# EAGLE schematic bc-module-probe (EAGLE 7.7.0)
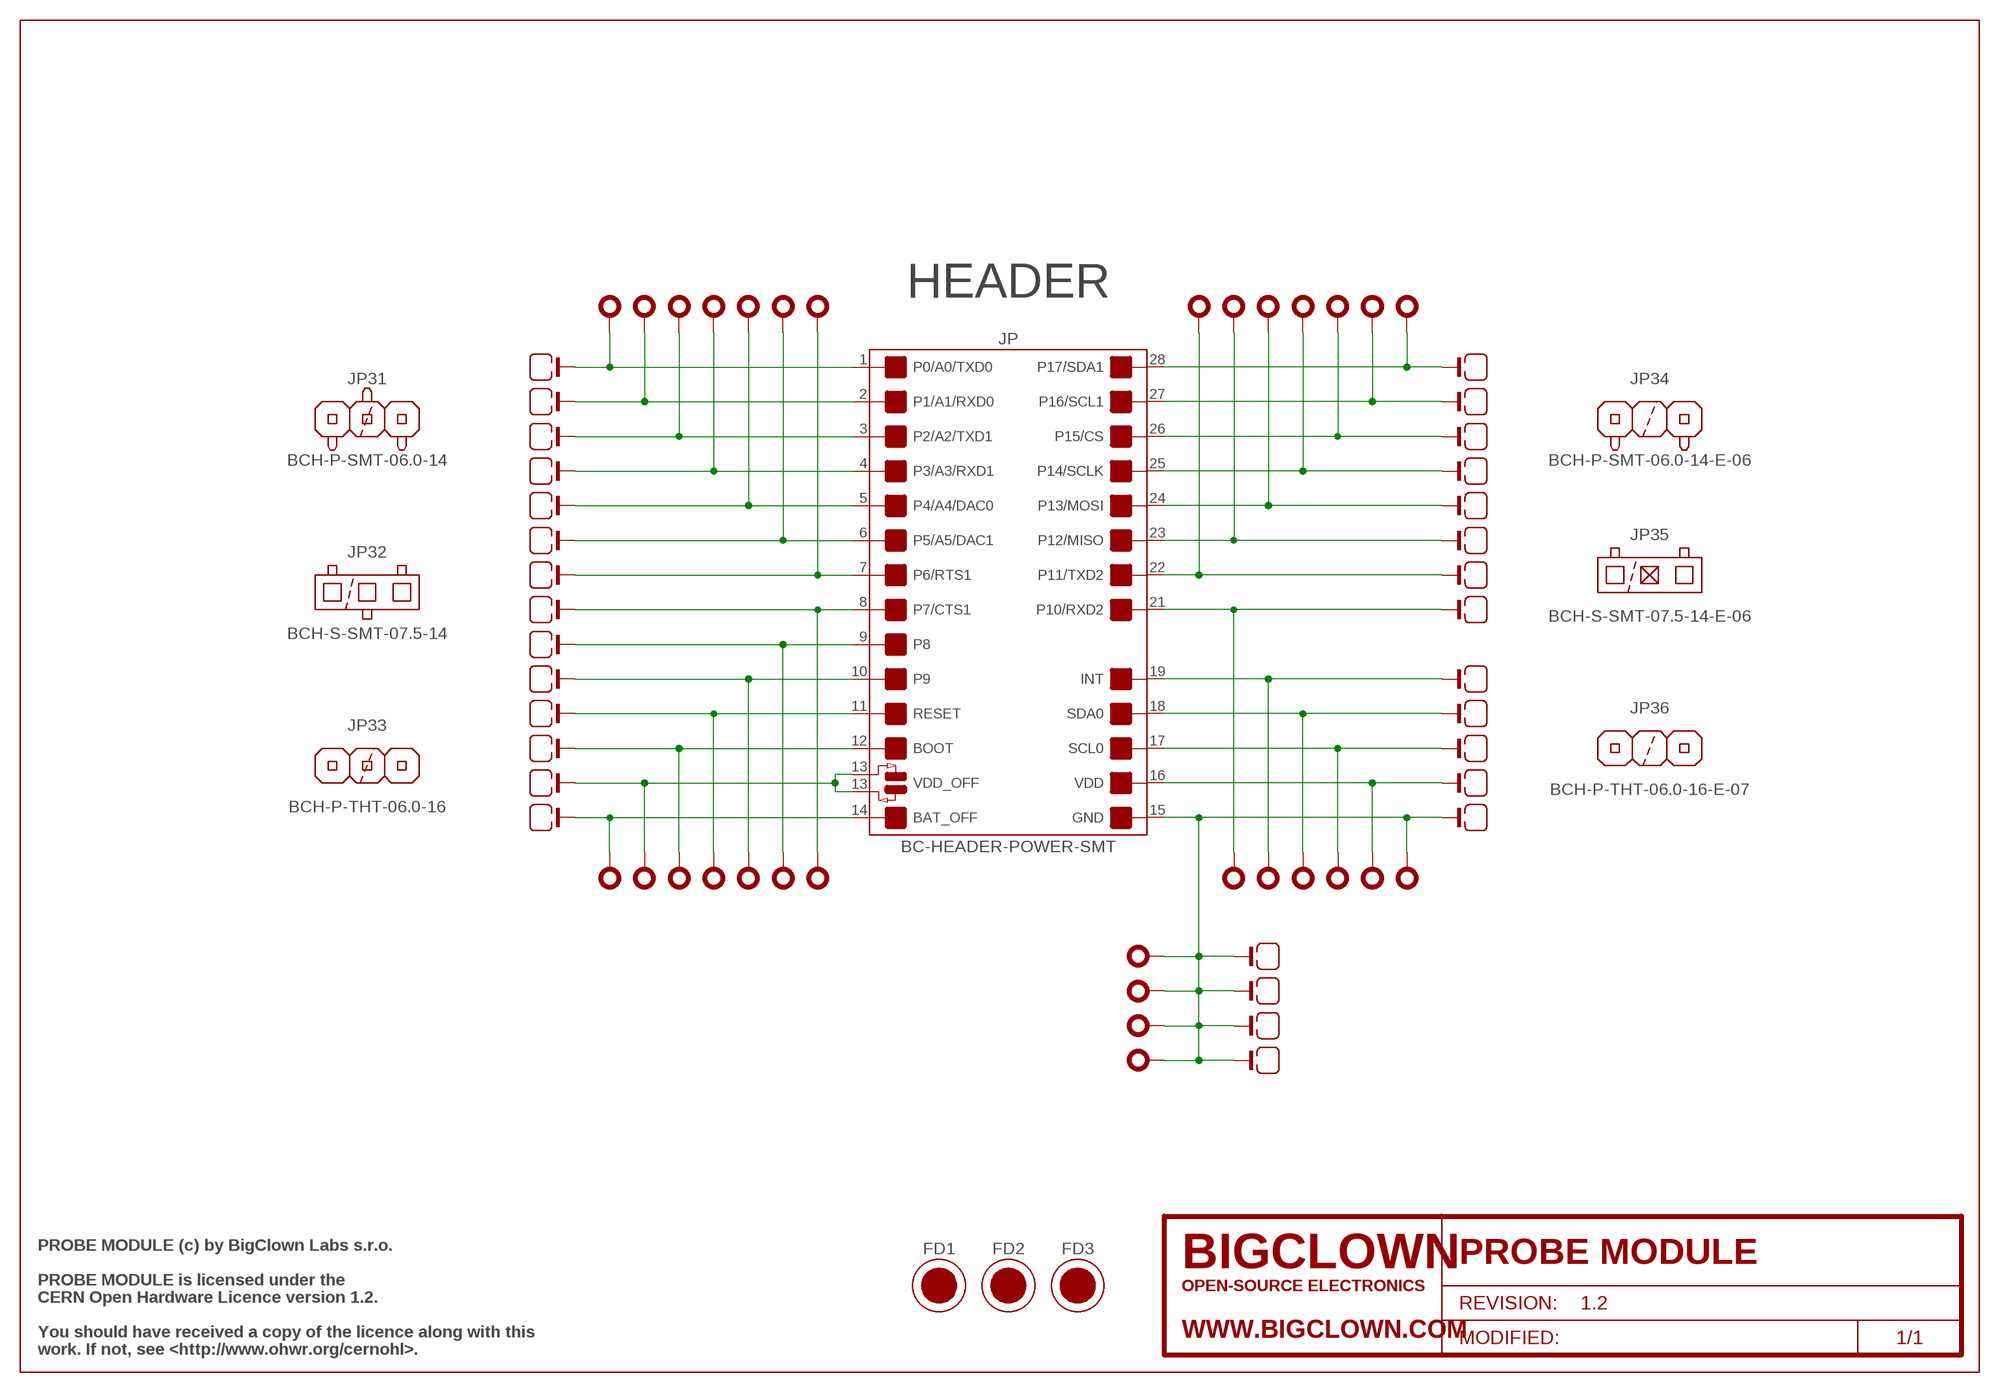
[diagram p0: schematic, sheet 1]

## Parts
FD1  FIDUCIAL  [FIDUCIAL-1MM]
FD2  FIDUCIAL  [FIDUCIAL-1MM]
FD3  FIDUCIAL  [FIDUCIAL-1MM]
FRAME1  FRAME-SCH/A4L-BRD/A4L  [FRAME-A4L]
JP  BC-HEADER-POWER-SMT  [BC-HEADER-POWER-SMT]
JP1  BC-HEADER-PIN-THT  [BC-HEADER-PIN-THT]
JP2  BC-HEADER-PIN-THT  [BC-HEADER-PIN-THT]
JP3  BC-HEADER-PIN-THT  [BC-HEADER-PIN-THT]
JP4  BC-HEADER-PIN-THT  [BC-HEADER-PIN-THT]
JP5  BC-HEADER-PIN-THT  [BC-HEADER-PIN-THT]
JP6  BC-HEADER-PIN-THT  [BC-HEADER-PIN-THT]
JP7  BC-HEADER-PIN-THT  [BC-HEADER-PIN-THT]
JP8  BC-HEADER-PIN-THT  [BC-HEADER-PIN-THT]
JP9  BC-HEADER-PIN-THT  [BC-HEADER-PIN-THT]
JP10  BC-HEADER-PIN-THT  [BC-HEADER-PIN-THT]
JP11  BC-HEADER-PIN-THT  [BC-HEADER-PIN-THT]
JP12  BC-HEADER-PIN-THT  [BC-HEADER-PIN-THT]
JP13  BC-HEADER-PIN-THT  [BC-HEADER-PIN-THT]
JP14  BC-HEADER-PIN-THT  [BC-HEADER-PIN-THT]
JP15  BC-HEADER-PIN-THT  [BC-HEADER-PIN-THT]
JP16  BC-HEADER-PIN-THT  [BC-HEADER-PIN-THT]
JP17  BC-HEADER-PIN-THT  [BC-HEADER-PIN-THT]
JP18  BC-HEADER-PIN-THT  [BC-HEADER-PIN-THT]
JP19  BC-HEADER-PIN-THT  [BC-HEADER-PIN-THT]
JP21  BC-HEADER-PIN-THT  [BC-HEADER-PIN-THT]
JP22  BC-HEADER-PIN-THT  [BC-HEADER-PIN-THT]
JP23  BC-HEADER-PIN-THT  [BC-HEADER-PIN-THT]
JP24  BC-HEADER-PIN-THT  [BC-HEADER-PIN-THT]
JP25  BC-HEADER-PIN-THT  [BC-HEADER-PIN-THT]
JP26  BC-HEADER-PIN-THT  [BC-HEADER-PIN-THT]
JP27  BC-HEADER-PIN-THT  [BC-HEADER-PIN-THT]
JP28  BC-HEADER-PIN-THT  [BC-HEADER-PIN-THT]
JP31  BCH-P-SMT-06.0-14  JP-BCH-P-SMT-06.0-14  [BCH-P-SMT-14]
JP32  BCH-S-SMT-07.5-14  JP-BCH-S-SMT-07.5-14  [BCH-S-SMT-14]
JP33  BCH-P-THT-06.0-16  JP-BCH-P-THT-06.0-16  [BCH-P-THT-16]
JP34  BCH-P-SMT-06.0-14-E-06  JP-BCH-P-SMT-06.0-14-E-06  [BCH-P-SMT-14-E-06]
JP35  BCH-S-SMT-07.5-14-E-06  JP-BCH-S-SMT-07.5-14-E-06  [BCH-S-SMT-14-E-06]
JP36  BCH-P-THT-06.0-16-E-07  JP-BCH-P-THT-06.0-16-E-07  [BCH-P-THT-16-E07]
JPG1  BC-HEADER-PIN-THT  [BC-HEADER-PIN-THT]
JPG2  BC-HEADER-PIN-THT  [BC-HEADER-PIN-THT]
JPG3  BC-HEADER-PIN-THT  [BC-HEADER-PIN-THT]
JPG4  BC-HEADER-PIN-THT  [BC-HEADER-PIN-THT]
JS1  KEYSTONE-5019  JP-KEYSTONE-5019  [KEYSTONE-5019_R]
JS2  KEYSTONE-5019  JP-KEYSTONE-5019  [KEYSTONE-5019_R]
JS3  KEYSTONE-5019  JP-KEYSTONE-5019  [KEYSTONE-5019_R]
JS4  KEYSTONE-5019  JP-KEYSTONE-5019  [KEYSTONE-5019_R]
JS5  KEYSTONE-5019  JP-KEYSTONE-5019  [KEYSTONE-5019_R]
JS6  KEYSTONE-5019  JP-KEYSTONE-5019  [KEYSTONE-5019_R]
JS7  KEYSTONE-5019  JP-KEYSTONE-5019  [KEYSTONE-5019_R]
JS8  KEYSTONE-5019  JP-KEYSTONE-5019  [KEYSTONE-5019_R]
JS9  KEYSTONE-5019  JP-KEYSTONE-5019  [KEYSTONE-5019_R]
JS10  KEYSTONE-5019  JP-KEYSTONE-5019  [KEYSTONE-5019_R]
JS11  KEYSTONE-5019  JP-KEYSTONE-5019  [KEYSTONE-5019_R]
JS12  KEYSTONE-5019  JP-KEYSTONE-5019  [KEYSTONE-5019_R]
JS13  KEYSTONE-5019  JP-KEYSTONE-5019  [KEYSTONE-5019_R]
JS14  KEYSTONE-5019  JP-KEYSTONE-5019  [KEYSTONE-5019_R]
JS15  KEYSTONE-5019  JP-KEYSTONE-5019  [KEYSTONE-5019_R]
JS16  KEYSTONE-5019  JP-KEYSTONE-5019  [KEYSTONE-5019_R]
JS17  KEYSTONE-5019  JP-KEYSTONE-5019  [KEYSTONE-5019_R]
JS18  KEYSTONE-5019  JP-KEYSTONE-5019  [KEYSTONE-5019_R]
JS19  KEYSTONE-5019  JP-KEYSTONE-5019  [KEYSTONE-5019_R]
JS21  KEYSTONE-5019  JP-KEYSTONE-5019  [KEYSTONE-5019_R]
JS22  KEYSTONE-5019  JP-KEYSTONE-5019  [KEYSTONE-5019_R]
JS23  KEYSTONE-5019  JP-KEYSTONE-5019  [KEYSTONE-5019_R]
JS24  KEYSTONE-5019  JP-KEYSTONE-5019  [KEYSTONE-5019_R]
JS25  KEYSTONE-5019  JP-KEYSTONE-5019  [KEYSTONE-5019_R]
JS26  KEYSTONE-5019  JP-KEYSTONE-5019  [KEYSTONE-5019_R]
JS27  KEYSTONE-5019  JP-KEYSTONE-5019  [KEYSTONE-5019_R]
JS28  KEYSTONE-5019  JP-KEYSTONE-5019  [KEYSTONE-5019_R]
JSG1  KEYSTONE-5019  JP-KEYSTONE-5019  [KEYSTONE-5019_R]
JSG2  KEYSTONE-5019  JP-KEYSTONE-5019  [KEYSTONE-5019_R]
JSG3  KEYSTONE-5019  JP-KEYSTONE-5019  [KEYSTONE-5019_R]
JSG4  KEYSTONE-5019  JP-KEYSTONE-5019  [KEYSTONE-5019_R]

## Nets
BAT_OFF: JP14.0 JP.14(BAT_OFF) JS14.0
BOOT: JP12.0 JP.12(BOOT) JS12.0
GND: JP15.0 JP.15(GND) JPG1.0 JPG2.0 JPG3.0 JPG4.0 JS15.0 JSG1.0 JSG2.0 JSG3.0 JSG4.0
INT: JP19.0 JP.19(INT) JS19.0
P0/A0/TXD0: JP1.0 JP.1(P0/A0/TXD0) JS1.0
P1/A1/RXD0: JP2.0 JP.2(P1/A1/RXD0) JS2.0
P2/A2/TXD1: JP3.0 JP.3(P2/A2/TXD1) JS3.0
P3/A3/RXD1: JP4.0 JP.4(P3/A3/RXD1) JS4.0
P4/A4/DAC0: JP5.0 JP.5(P4/A4/DAC0) JS5.0
P5/A5/DAC1: JP6.0 JP.6(P5/A5/DAC1) JS6.0
P6/RTS1: JP7.0 JP.7(P6/RTS1) JS7.0
P7/CTS1: JP8.0 JP.8(P7/CTS1) JS8.0
P8: JP9.0 JP.9(P8) JS9.0
P9: JP10.0 JP.10(P9) JS10.0
P10/RXD2: JP21.0 JP.21(P10/RXD2) JS21.0
P11/TXD2: JP22.0 JP.22(P11/TXD2) JS22.0
P12/MISO: JP23.0 JP.23(P12/MISO) JS23.0
P13/MOSI: JP24.0 JP.24(P13/MOSI) JS24.0
P14/SCLK: JP25.0 JP.25(P14/SCLK) JS25.0
P15/CS: JP26.0 JP.26(P15/CS) JS26.0
P16/SCL1: JP27.0 JP.27(P16/SCL1) JS27.0
P17/SDA1: JP28.0 JP.28(P17/SDA1) JS28.0
RESET: JP11.0 JP.11(RESET) JS11.0
SCL0: JP17.0 JP.17(SCL0) JS17.0
SDA0: JP18.0 JP.18(SDA0) JS18.0
VDD: JP16.0 JP.16(VDD) JS16.0
VDD_OFF: JP13.0 JP.13B(VDD_OFF_OUT) JP.13T(VDD_OFF_IN) JS13.0

## Notes on the sheet
- HEADER
- PROBE MODULE (c) by BigClown Labs s.r.o.
- PROBE MODULE is licensed under the
- CERN Open Hardware Licence version 1.2.
- You should have received a copy of the licence along with this
- work. If not, see <http://www.ohwr.org/cernohl>.

## Library data of the parts
FD1-FD3 = bc-fiducial:FIDUCIAL; BCPN: -
FRAME1 = bc-frame:FRAME-SCH/A4L-BRD/A4L; BCPN: -; PROJECT_NAME: PROBE MODULE; PROJECT_REVISION: 1.2
JP = bc-header:BC-HEADER-POWER-SMT; BCPN: -
JP1-JP19 JP21-JP28 JPG1-JPG4 = bc-header:BC-HEADER-PIN-THT; BCPN: -
JP31 = bc-header:JP-BCH-P-SMT-06.0-14; BCPN: BC-JP-BCH-P-SMT-06.0-14
JP32 = bc-header:JP-BCH-S-SMT-07.5-14; BCPN: BC-JP-BCH-S-SMT-07.5-14
JP33 = bc-header:JP-BCH-P-THT-06.0-16; BCPN: BC-JP-BCH-P-THT-06.0-16
JP34 = bc-header:JP-BCH-P-SMT-06.0-14-E-06; BCPN: BC-JP-BCH-P-SMT-06.0-14-E-06
JP35 = bc-header:JP-BCH-S-SMT-07.5-14-E-06; BCPN: BC-JP-BCH-S-SMT-07.5-14-E-06
JP36 = bc-header:JP-BCH-P-THT-06.0-16-E-07; BCPN: BC-JP-BCH-P-THT-06.0-16-E-07
JS1-JS19 JS21-JS28 JSG1-JSG4 = bc-connector:JP-KEYSTONE-5019; BCPN: BC-JP-KEYSTONE-5019